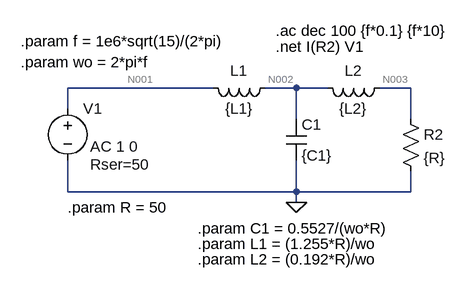
[diagram p0: schematic Bessel_PB_ord3_i5.asc]
Bessel_PB_ord3_i5.asc, the LTspice schematic file:
Version 4
SHEET 1 880 680
WIRE 192 64 -32 64
WIRE 320 64 272 64
WIRE 368 64 320 64
WIRE 496 64 448 64
WIRE -32 96 -32 64
WIRE 320 112 320 64
WIRE 496 112 496 64
WIRE -32 224 -32 176
WIRE 320 224 320 176
WIRE 320 224 -32 224
WIRE 496 224 496 192
WIRE 496 224 320 224
WIRE 320 240 320 224
FLAG 320 240 0
SYMBOL voltage -32 80 R0
WINDOW 123 35 74 Left 2
WINDOW 39 35 102 Left 2
SYMATTR InstName V1
SYMATTR Value ""
SYMATTR Value2 AC 1 0
SYMATTR SpiceLine Rser=50
SYMBOL ind 288 48 R90
WINDOW 0 5 56 VBottom 2
WINDOW 3 32 56 VTop 2
SYMATTR InstName L1
SYMATTR Value {L1}
SYMBOL ind 464 48 R90
WINDOW 0 5 56 VBottom 2
WINDOW 3 32 56 VTop 2
SYMATTR InstName L2
SYMATTR Value {L2}
SYMBOL cap 304 112 R0
SYMATTR InstName C1
SYMATTR Value {C1}
SYMBOL res 480 96 R0
SYMATTR InstName R2
SYMATTR Value {R}
TEXT -104 -8 Left 2 !.param f = 1e6*sqrt(15)/(2*pi)
TEXT -104 24 Left 2 !.param wo = 2*pi*f
TEXT -32 248 Left 2 !.param R = 50
TEXT 168 280 Left 2 !.param C1 = 0.5527/(wo*R)
TEXT 168 304 Left 2 !.param L1 = (1.255*R)/wo
TEXT 168 328 Left 2 !.param L2 = (0.192*R)/wo
TEXT 288 0 Left 2 !.net I(R2) V1
TEXT 288 -24 Left 2 !.ac dec 100 {f*0.1} {f*10}

The netlist it stands for:
* Bessel_PB_ord3_i5.asc
V1 N001 0 AC 1 0 Rser=50
L1 N002 N001 {L1}
L2 N003 N002 {L2}
C1 N002 0 {C1}
R2 N003 0 {R}
.param f = 1e6*sqrt(15)/(2*pi)
.param wo = 2*pi*f
.param R = 50
.param C1 = 0.5527/(wo*R)
.param L1 = (1.255*R)/wo
.param L2 = (0.192*R)/wo
.net I(R2) V1
.ac dec 100 {f*0.1} {f*10}
.backanno
.end

* Results of the author's LTspice run, read from the files saved beside the schematic
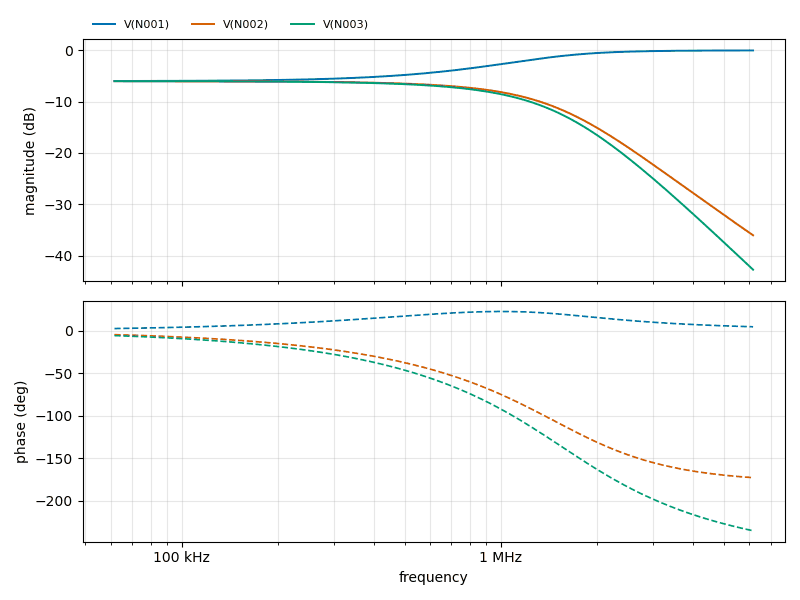
[diagram p1: AC Analysis of Bessel_PB_ord3_i5.asc, plotted from the saved traces]
* AC Analysis, 1 run:
*   V(N001): -6.00 dB at 61.64 kHz, -0.03 dB at 6.164 MHz, peak -0.03 dB at 6.164 MHz, 3 dB below the peak at 916 kHz
*   V(N002): -6.03 dB at 61.64 kHz, -36.05 dB at 6.164 MHz, peak -6.03 dB at 61.64 kHz, 3 dB below the peak at 1.168 MHz
*   V(N003): -6.03 dB at 61.64 kHz, -42.76 dB at 6.164 MHz, peak -6.03 dB at 61.64 kHz, 3 dB below the peak at 1.083 MHz